# Altium schematic sheet PSU.SchDoc: POWER SUPPLY
size A4; Date: 30 08 2013; Author: Rachid AKKOUCHE; CompanyName: RASoftware; DrawnBy: Rachid AKKOUCHE; Engineer: Rachid AKKOUCHE; Organization: RASoftware; Address1: 52 J03, rue de la crèche; Address2: 77100 MEAUX; Address3: FRANCE; DocumentNumber: BRA201308308C; Revision: C; SheetNumber: 8; SheetTotal: 11; Telephone: +33651604047; Email: rachid.akkouche@wanadoo.fr; Proprietaire: MDI System; Dessinepar: -; Verifiepar: -; Time: 19:00
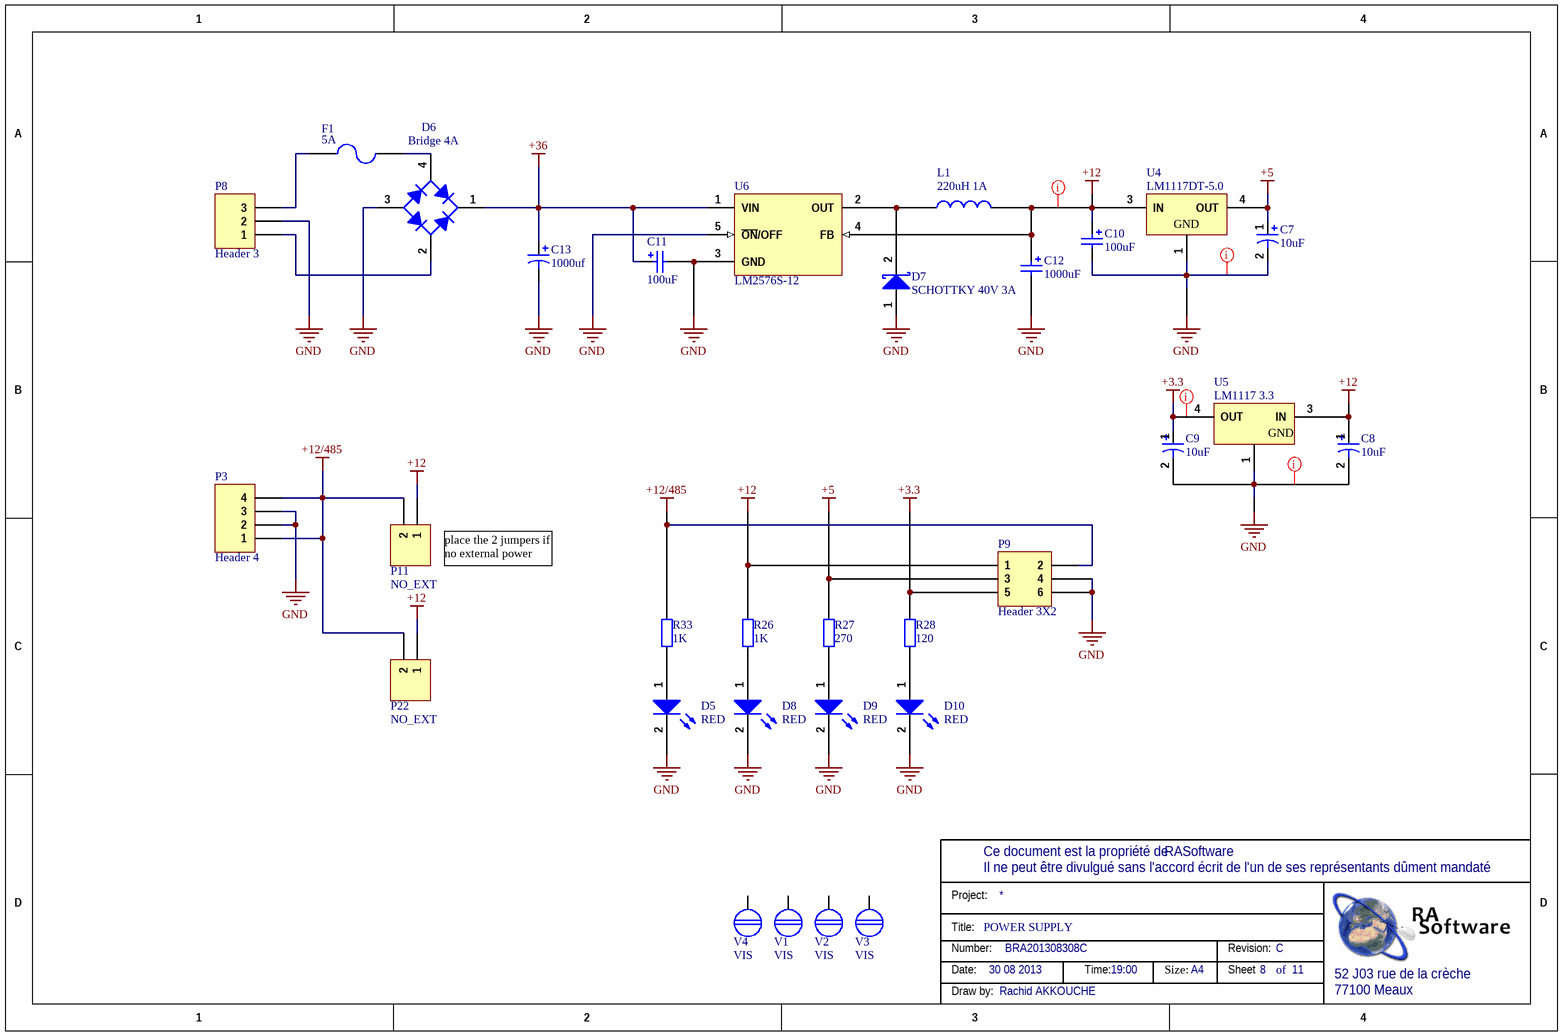
[diagram p0: PSU.SchDoc]

## Parts
C7  10uF  [KEMET_4]
C8  10uF  [KEMET_4]
C9  10uF  [KEMET_4]
C10  100uF  [Kemet_63]
C11  100uF  [Kemet_63]  (no BOM)
C12  1000uF  [KEMET_10]
C13  1000uf  [Capa Panasonic size J16]
D5  Couleur: RED  [0603-LEDR]  (hidden comment: HSMH-C190)
D6  Bridge 4A  [Pont GBU]
D7  SCHOTTKY 40V 3A  [DO220AA]
D8  Couleur: RED  [0603-LEDR]  (hidden comment: HSMH-C190)
D9  Couleur: RED  [0603-LEDR]  (hidden comment: HSMH-C190)
D10  Couleur: RED  [0603-LEDR]  (hidden comment: HSMH-C190)
F1  5A  [FUS5X20]
L1  220uH 1A  [IND-1422435C]
P3  Header 4  [CO4P508]
P8  Header 3  [CO3P508]
P9  Header 3X2  [M20-2X3]  (no BOM)
P11  NO_EXT  [M20_1X2]
P22  NO_EXT  [M20_1X2]
R26  1K  [R0805]
R27  270  [R0805]
R28  120  [R0805]
R33  1K  [R0805]
U4  LM1117DT-5.0  [SOT223]
U5  LM1117 3.3  [TO252]
U6  LM2576S-12  [TO263-5]
V1  VIS  [VIS42]  (no BOM)
V2  VIS  [VIS42]  (no BOM)
V3  VIS  [VIS42]  (no BOM)
V4  VIS  [VIS42]  (no BOM)

## Nets
+3.3: C9.1 P9.5 R28.2 U5.4(OUT)
+5: C7.1 P9.3 R27.2 U4.4(OUT)
+12: C8.1 C10.1 C12.1 L1.2 P9.1 P11.1 P22.1 R26.2 U4.3(IN) U5.3(IN) U6.4(FB)
+12/485: P3.1 P3.4 P9.2 P11.2 P22.2 R33.2
+36: C11.1 C13.1 D6.1(K) U6.1(VIN)
GND: C7.2 C8.2 C9.2 C10.2 C11.2 C12.2 C13.2 D5.2(K) D6.3(A) D7.1(A) D8.2(K) D9.2(K) D10.2(K) P3.2 P3.3 P8.2 P9.4 P9.6 U4.1(GND) U5.1(GND) U6.3(GND) U6.5(~{ON}/OFF)
NetD5_1: D5.1(A) R33.1
NetD6_2: D6.2(C) P8.1
NetD6_4: D6.4(C) F1.2
NetD7_2: D7.2(K) L1.1 U6.2(OUT)
NetD8_1: D8.1(A) R26.1
NetD9_1: D9.1(A) R27.1
NetD10_1: D10.1(A) R28.1
NetF1_1: F1.1 P8.3

Not connected (* = marked no-connect by the designer): V1 1; V2 1; V3 1; V4 1

## Layout directives
rule Width Constraint [Pref Width = 0.55mm    Min Width = 0.254mm    Max Width = 2mm]: +3.3, +12, GND

## Notes on the sheet
- (near P11) place the 2 jumpers if no external power
- Ce document est la propriété de
- Project:
- Il ne peut être divulgué sans l'accord écrit de l'un de ses représentants dûment mandaté
- Title:
- Number:
- Date:
- Time:
- Size:
- A4
- Revision:
- Sheet
- of
- 52 J03 rue de la crèche
- Draw by:
- 77100 Meaux

## Library data of the parts
C7-C9 = Cap Pol1: Polarized Capacitor; Manufacturer: KEMET; Manufacturer Part Number: EXV106M025A9BAA; Supplier 1: Farnell; Supplier Part Number 1: 2069174; RoHS: YES; Pricing 1: 10=0,111, 100=0,085, 500=0,074, 1000=0,07, 5000=0,066 (EUR); ComponentLink1URL: http://www.farnell.com/datasheets/1500293.pdf; ComponentLink1Description: http://www.farnell.com/datasheets/1500293.pdf
C10 C11 = Cap Pol 100uF: Polarized Capacitor; Manufacturer: EPCOS; Manufacturer Part Number: B41142A4107M; Product Range: EPCOS - B41142 Series; Capacité: 100; Tolérance de capacité: ± 20%; Tension: 16; Type de boîtier de condensateur: Radial Can - SMD; Diamètre: 6.3; Résistance, ESR: 0.16; Hauteur: 7.7; Courant d'ondulation c.a.: 300; Type de packaging: Cut Tape; Durée de vie @ température: 2000 heures @ 105; Température d'utilisation min: -55; Température de fonctionnement max..: 105; SVHC: No SVHC (19-Dec-2012); Impédance: 0.26; Température de fonctionnement: -55°C à +105; Température, ESR: 20; Type de boîtier: CMS; Supplier 1: Farnell; RoHS: YES; Pricing 1: 10=0,123, 50=0,095, 100=0,078, 250=0,07, 1000=0,062 (EUR); Courant d'ondulation c.a. à  100Hz: 300; Fréquence, impédance: 100; Longueur/hauteur: 7.7; Température, courant ondulatoire: 105; Température, impédance: 20; ComponentLink1URL: http://www.epcos.com/inf/20/30/db/alu_x/B41142.pdf; ComponentLink1Description: http://www.epcos.com/inf/20/30/db/alu_x/B41142.pdf; Supplier Part Number 1: 1735328
C12 = Cap Pol 1000uF: Polarized Capacitor; Manufacturer: PANASONIC; Manufacturer Part Number: EEEFT1C102AP; Product Range: PANASONIC - FT Series; Capacité: 1000; Tolérance de capacité: ± 20%; Tension: 16; Type de boîtier de condensateur: Radial Can - SMD; Diamètre: 10; Résistance, ESR: 0.06; Hauteur: 10.2; Courant d'ondulation c.a.: 1190; Type de packaging: Cut Tape; Durée de vie @ température: 2000 heures @ 105; Température d'utilisation min: -55; Température de fonctionnement max..: 105; Température de fonctionnement: -55°C à +105; Supplier 1: Farnell; Supplier Part Number 1: 2065974; RoHS: YES; Pricing 1: 5=1,16, 50=0,76, 100=0,49, 500=0,45, 1000=0,44 (EUR); ComponentLink1URL: http://industrial.panasonic.com/www-data/pdf/ABA0000/ABA0000CE135.pdf; ComponentLink1Description: http://industrial.panasonic.com/www-data/pdf/ABA0000/ABA0000CE135.pdf; ComponentLink2URL: http://www.farnell.com/cad/1703921.zip; ComponentLink2Description: http://www.farnell.com/cad/1703921.zip
C13 = Cap Pol1: Polarized Capacitor (Radial); Manufacturer: PANASONIC; Manufacturer Part Number: EEVFK1H102M; Supplier 1: Farnell; Supplier Part Number 1: 9695982; RoHS: YES; Pricing 1: 1=1,91, 50=1,58, 100=0,82, 500=0,79, 1000=0,77 (EUR); ComponentLink1URL: http://industrial.panasonic.com/www-data/pdf/ABA0000/ABA0000CE120.pdf; ComponentLink1Description: http://industrial.panasonic.com/www-data/pdf/ABA0000/ABA0000CE120.pdf; ComponentLink2URL: http://www.farnell.com/cad/1703914.zip; ComponentLink2Description: http://www.farnell.com/cad/1703914.zip
D5 D8-D10 = HSMH-C190: Surface Mount Chip LED, Red; Manufacturer: AVAGO TECHNOLOGIES; Manufacturer Part Number: HSMH-C190.; Taille de lampe: 0.8mm x 1; Couleur de LED: Rouge; Intensité lumineuse: 17; Angle, vision: 170°; Courant, direct, If: 20; Tension, direct à  If: 1.8; Montage LED: CMS; Forme de lentille: Rectangulaire; Longueur d'onde typ.: 626; SVHC: No SVHC (19-Dec-2012); Dissipation de puissance: 65; Intensité lumineuse min. à  If: 2.8; Intensité lumineuse typique: 10; Largeur (externe): 0.8; Longueur d'onde dominante: 639; Longueur d'onde, crête: 630; Longueur/hauteur: 1.6; Matière: AlGaAs; Nombre de broches: 2; Orientation de montage opto: Dessus; Orientation sortie de lumière: Top Emitting; Température de fonctionnement: -30°C à +85; Température de fonctionnement max..: 85; Température, stockage min.: -40; Température d'utilisation min: -30; Tension, Vf max..: 2.6; Tension, Vf min.: 2.1; Type de LED: Standard; Supplier 1: Farnell; Supplier Part Number 1: 8554641; RoHS: YES; Stock 1: 13902; Pricing 1: 5=0,06, 25=0,059, 100=0,057, 250=0,052, 500=0,047 (EUR); MSL: MSL 2A - 4 semaines; Couleur, LED: Rouge; Profondeur: 0.8; Température, stockage max..: 85; Tension, Vf typ.: 1.8; ComponentLink1URL: http://www.farnell.com/datasheets/313031.pdf; ComponentLink1Description: http://www.farnell.com/datasheets/313031.pdf; ComponentLink2URL: http://www.farnell.com/datasheets/55927.pdf; ComponentLink2Description: http://www.farnell.com/datasheets/55927.pdf
D6 = Bridge1: Full Wave Diode Bridge; Manufacturer: VISHAY GENERAL SEMICONDUCTOR; Manufacturer Part Number: GBU6B-E3/45; Nombre de phases: Une; Tension, Vrrm: 100; Courant, If moy.: 6; Tension, Vf max..: 1; Type de boîtier pont redresseur: GBU; Nombre de broches: 4; Diode Mounting Type: Traversant; Température d'utilisation min: -55; Température de fonctionnement max..: 150; Configuration diode: Double; Courant, Ifs max.: 175; Diode Type: Pont redresseur, monophasé; Hauteur: 18.8; Inflammabilité: UL; Largeur (externe): 22.3; Marquage composant: GBU6; Profondeur: 3.56; Température de fonctionnement: -55°C à +150; Température, Ta: 40; Tension, entrée: 70; Type de borne: Wire lead; Supplier 1: Farnell; Supplier Part Number 1: 9549480; RoHS: YES; Pricing 1: 1=0,53, 25=0,51, 100=0,5, 1000=0,49 (EUR); Courant, sortie max.: 6; Hauteur corps max..: 18.8; Longueur/hauteur: 18.8; Tension, entrée efficace: 70; Type de boîtier: GBU; ComponentLink1URL: http://www.vishay.com/doc?88615; ComponentLink1Description: http://www.vishay.com/doc?88615
D7 = D Schottky: Schottky Diode; Manufacturer: VISHAY; Manufacturer Part Number: SS3P4-M3/84A; Configuration diode: Une; Tension, Vrrm: 40; Courant, If moy.: 3; Tension, Vf max..: 600; Courant, Ifs max.: 50; Température d'utilisation min: -55; Température de fonctionnement max..: 150; Type de boîtier diode: SMP; Nombre de broches: 2; Température de fonctionnement: -55°C à +150; Published: 8-Jun-2000; LatestRevisionDate: 17-Jul-2002; LatestRevisionNote: Re-released for DXP Platform.; PackageReference: SMB; Publisher: Altium Limited; PackageDescription: DO-214-AA/SMB; 2 C-Bend Leads; Body 5.3 x 3.6 mm, inc. leads (LxW); Code_JEDEC: DO-214-AA; Supplier 1: Farnell; Supplier Part Number 1: 1812492; RoHS: YES; Pricing 1: 1=0,25, 25=0,21, 100=0,192, 250=0,188, 500=0,183 (EUR); Diode Type: Schottky; ComponentLink1URL: http://www.vishay.com/docs/88954/ss3p4.pdf; ComponentLink1Description: http://www.vishay.com/docs/88954/ss3p4.pdf
F1 = Fuse 2: Fuse; Manufacturer: KEYSTONE; Manufacturer Part Number: 4527; Fusible 5X20: 1123209; Published: 8-Jun-2000; LatestRevisionDate: 17-Jul-2002; LatestRevisionNote: Re-released for DXP Platform.; PackageReference: PIN-W2/E2.8; Publisher: Altium Limited; PackageDescription: Thru-Hole; 2 Leads; Supplier 1: Farnell; Supplier Part Number 1: 2301274+2301275+1123183; RoHS: YES; Pricing 1: 1=0,59, 250=0,45, 500=0,4, 1000=0,36, 5000=0,33 (EUR); ComponentLink1URL: http://www.keyelco.com/userAssets/file/M60p42.pdf; ComponentLink1Description: http://www.keyelco.com/userAssets/file/M60p42.pdf
L1 = Inductor: Manufacturer: MULTICOMP; Manufacturer Part Number: MCBFS7330-221MU; Gamme de produit: MULTICOMP - MCB Series; Inductance: 220; Tolérance d'Inductance: ± 20%; Construction inductance: Blindé; Résistance DC max.: 0.47; Courant efficace (Irms): 1.2; Type de packaging: Bande découpée; Largeur (externe): 15.24; Longueur/hauteur: 18.54; Nombre de broches: 2; Pas: 12.7; Profondeur: 7.62; Série: MCB<!--FANDB--><div class="features-and-benefits-container"></div>; Supplier 1: Farnell; Supplier Part Number 1: 1864291; RoHS: YES; Stock 1: 2348; Pricing 1: 5=0,37, 50=0,32, 100=0,27, 500=0,25, 1000=0,22 (EUR); Dimensions Boîtier: 18.54mm x 15.24mm x 7.62; ComponentLink1URL: http://www.farnell.com/datasheets/1684913.pdf; ComponentLink1Description: http://www.farnell.com/datasheets/1684913.pdf
P3 = Header 4: Header, 4-Pin; LatestRevisionDate: 17-Jul-2002; LatestRevisionNote: Re-released for DXP Platform.; Publisher: Altium Limited
P8 = Header 3: Header, 3-Pin; Manufacturer: TE CONNECTIVITY / BUCHANAN; Manufacturer Part Number: 796636-3; LatestRevisionDate: 17-Jul-2002; LatestRevisionNote: Re-released for DXP Platform.; Publisher: Altium Limited; Supplier 1: Farnell; Supplier Part Number 1: 2059780; RoHS: YES; Pricing 1: 10=0,68, 100=0,51, 500=0,43, 1000=0,36, 2000=0,35, 5000=0,33 (EUR); ComponentLink1URL: http://www.farnell.com/cad/1652960.pdf; ComponentLink1Description: http://www.farnell.com/cad/1652960.pdf; ComponentLink2URL: http://www.farnell.com/datasheets/1650926.pdf; ComponentLink2Description: http://www.farnell.com/datasheets/1650926.pdf
P9 = Header 3X2: Header, 3-Pin, Dual row; Manufacturer: TE CONNECTIVITY / AMP; Manufacturer Part Number: 1241050-3; LatestRevisionDate: 17-Jul-2002; LatestRevisionNote: Re-released for DXP Platform.; Publisher: Altium Limited; Supplier 1: Farnell; Supplier Part Number 1: 9689567; RoHS: YES; Pricing 1: 1=1,26, 10=1,22, 50=1,2, 100=1,16 (EUR); ComponentLink1URL: http://www.tycoelectronics.com/commerce/DocumentDelivery/DDEController?Action=srchrtrv&DocNm=1241050-3&DocType=Customer+View+Model&DocLang=English; ComponentLink1Description: http://www.tycoelectronics.com/commerce/DocumentDelivery/DDEController?Action=srchrtrv&DocNm=1241050-3&DocType=Customer+View+Model&DocLang=English; ComponentLink2URL: http://www.te.com/commerce/DocumentDelivery/DDEController?Action=showdoc&DocId=Customer+Drawing%7F1241050%7FA9%7Fpdf%7FEnglish%7FENG_CD_1241050_A9.pdf%7F1241050-5; ComponentLink2Description: http://www.te.com/commerce/DocumentDelivery/DDEController?Action=showdoc&DocId=Customer+Drawing%7F1241050%7FA9%7Fpdf%7FEnglish%7FENG_CD_1241050_A9.pdf%7F1241050-5; ComponentLink3URL: http://www.farnell.com/datasheets/318453.pdf; ComponentLink3Description: http://www.farnell.com/datasheets/318453.pdf
P11 P22 = Header 2: Header, 2-Pin; Manufacturer: HARWIN; Manufacturer Part Number: M20-8770242; Product Range: HARWIN - M20-87 Series; Terminaison du contact: PCB; Genre: Connecteur mâle; Nombre de contacts: 2; Nombre de rangées: 1; Pas: 2.54; Plaquage du contact: Or; Matériau du contact: Laiton; SVHC: No SVHC (20-Jun-2013); LatestRevisionDate: 17-Jul-2002; LatestRevisionNote: Re-released for DXP Platform.; Publisher: Altium Limited; Supplier 1: Farnell; Supplier Part Number 1: 1895211; RoHS: YES; Pricing 1: 10=0,137, 20=0,136, 50=0,135, 100=0,133, 250=0,128, 500=0,12 (EUR); ComponentLink1URL: http://www.farnell.com/cad/1330190.pdf; ComponentLink1Description: http://www.farnell.com/cad/1330190.pdf
R26 R28 R33 = Resistor 0805 1K: Resistor; Manufacturer: MULTICOMP; Manufacturer Part Number: MC0.1W08051%1KFR; Product Range: MULTICOMP - MC Series; Résistance: 1; Puissance: 100; Tolérance de résistance: ± 1%; Type de boîtier de résistance: 0805; Type de résistance: Couche épaisse; Coefficient de température: ± 100; Tension: 150; Type de packaging: Full Reel; Resistor Mounting: CMS; Supplier 1: Farnell; RoHS: YES; Pricing 1: 5000=0,001 (EUR); MSL: MSL 1 - Illimité; ComponentLink1URL: http://www.farnell.com/datasheets/1716700.pdf; ComponentLink1Description: http://www.farnell.com/datasheets/1716700.pdf; Supplier Part Number 1: 2129113
R27 = Resistor 0805 270: Resistor; Manufacturer: MULTICOMP; Manufacturer Part Number: MC01W08051270R; Product Range: MULTICOMP - MC Series; Puissance: 100; Tolérance de résistance: ± 1%; Type de boîtier de résistance: 0805; Type de résistance: Couche épaisse; Coefficient de température: ± 100; Tension: 150; Type de packaging: Full Reel; SVHC: No SVHC (20-Jun-2013); Resistor Mounting: CMS; Supplier 1: Farnell; RoHS: YES; Pricing 1: 5000=0,001 (EUR); Résistance: 270; MSL: (Non Applicable); ComponentLink1URL: http://www.farnell.com/datasheets/1729047.pdf; ComponentLink1Description: http://www.farnell.com/datasheets/1729047.pdf; Supplier Part Number 1: 2129067
U4 = LM1117DT-5.0: 800mA Low-Dropout Linear Regulator, 3-pin TO-252; Manufacturer: NXP; Manufacturer Part Number: NX1117C50Z; Tension d'entrée primaire: 20; Tension de sortie fixe: 5; Tension, déclenchement: 1.07; Type de boîtier CI régulateur de tension: SOT-223; Nombre de broches: 4; Courant, sortie: 800; Température d'utilisation min: -40; Température de fonctionnement max..: 125; SVHC: No SVHC (20-Jun-2013); Température de fonctionnement: -40°C à +125; Supplier 1: Farnell; Supplier Part Number 1: 2057275; RoHS: YES; Pricing 1: 1=0,36, 10=0,29, 100=0,26, 250=0,24, 500=0,22 (EUR); MSL: (Non Disponible); ComponentLink1URL: http://www.nxp.com/documents/data_sheet/NX1117C_NX1117CE_SER.pdf; ComponentLink1Description: http://www.nxp.com/documents/data_sheet/NX1117C_NX1117CE_SER.pdf; ComponentLink2URL: http://www.farnell.com/cad/1722034.zip; ComponentLink2Description: http://www.farnell.com/cad/1722034.zip
U5 = LM1117DT-3.3: 800mA Low-Dropout Linear Regulator, 3-pin TO-252; Manufacturer: DIODES INC.; Manufacturer Part Number: AP1117D33G-13; Tension d'entrée primaire: 18; Tension de sortie fixe: 3.3; Tension, déclenchement: 1.3; Nombre de broches: 3; Courant, sortie: 1; Température d'utilisation min: 0; Température de fonctionnement max..: 125; SVHC: No SVHC (19-Dec-2012); Racine de la référence: 1117; Température de fonctionnement: 0°C à +125; Supplier 1: Farnell; Supplier Part Number 1: 1825285; RoHS: YES; Stock 1: 2493; Pricing 1: 1=0,23, 10=0,21, 100=0,19, 250=0,181, 500=0,163 (EUR); Type de boîtier CI régulateur de tension: TO-252; Tension, sortie: 3.3; ComponentLink1URL: http://www.farnell.com/datasheets/608751.pdf; ComponentLink1Description: http://www.farnell.com/datasheets/608751.pdf
U6 = LM2576HVT-12: SIMPLE SWITCHER® 3A Step-Down Voltage Regulator, 5-pin TO-220; Manufacturer: TEXAS INSTRUMENTS; Manufacturer Part Number: LM2576HVS-12/NOPB; Tension d'entrée primaire: 60; Nombre de canaux de sortie: 1; Tension, sortie: 12; Courant, sortie: 3; Type de boîtier CI régulateur de tension: TO-263; Nombre de broches: 5; Température d'utilisation min: -40; Température de fonctionnement max..: 125; SVHC: No SVHC (20-Jun-2013); Racine de la référence: 2576; Température de fonctionnement: -40°C à +125; Supplier 1: Farnell; Supplier Part Number 1: 2115115; RoHS: YES; Pricing 1: 1=4,23, 10=3,19, 100=2,48, 250=2,41, 500=2,35 (EUR); MSL: MSL 3 - 168 heures; ComponentLink1URL: http://www.farnell.com/datasheets/1520137.pdf; ComponentLink1Description: http://www.farnell.com/datasheets/1520137.pdf